# EAGLE design Aldi Ambiano Reflow Oven #Main Board (EAGLE 8.7.0)
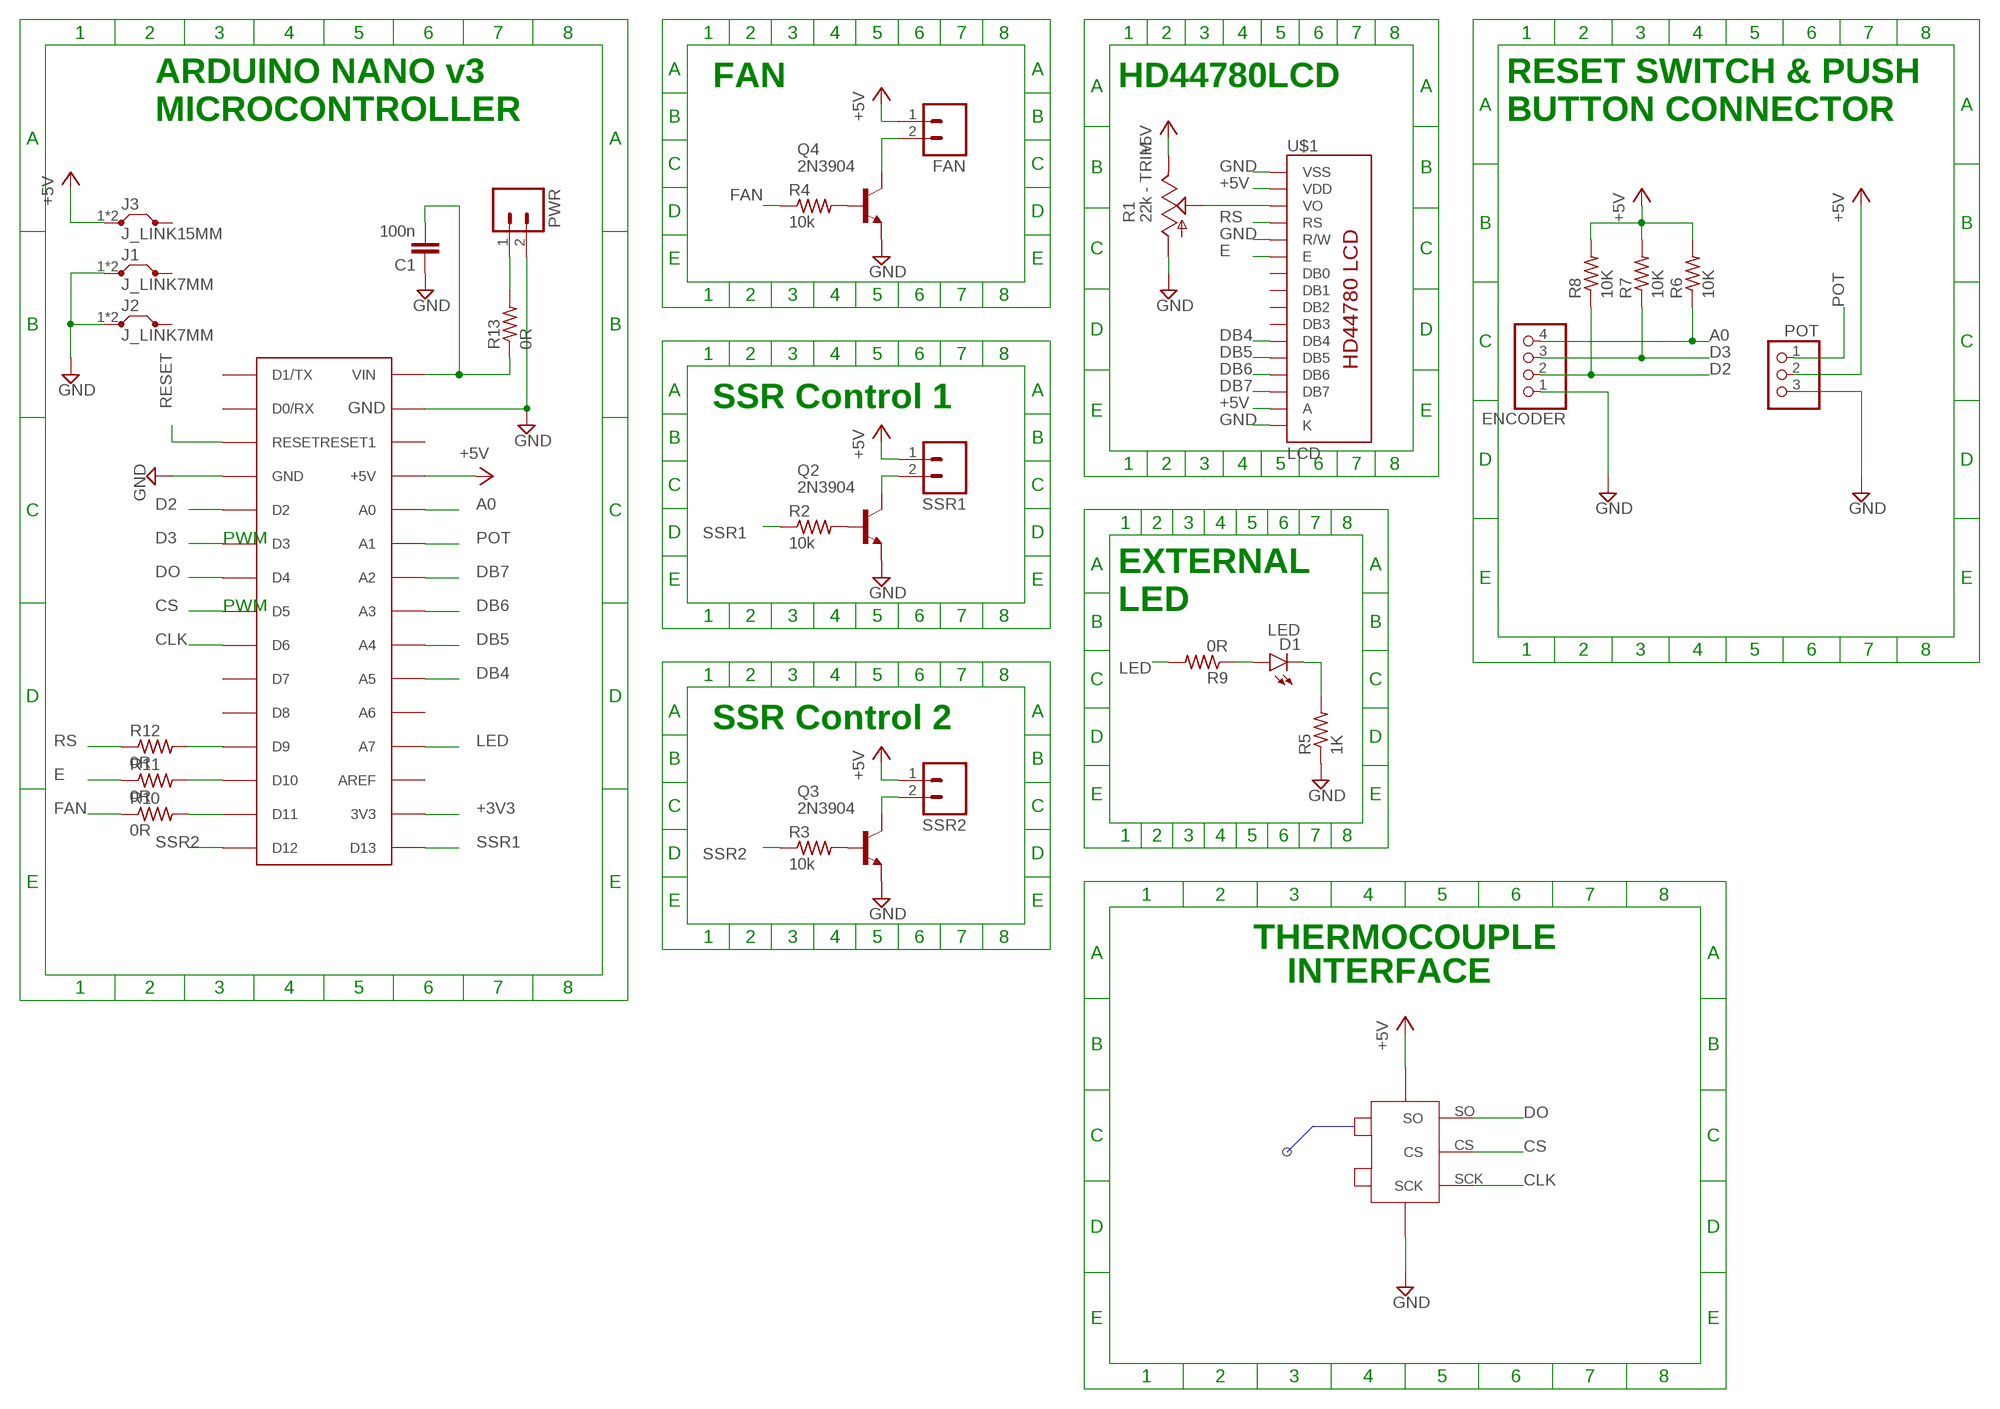
[diagram p0: schematic, sheet 1]

## Parts
ARDUINO  Arduino Nano v3.0  ARDUINONANO  [PDIP-32]
C1  100n  CAPPTH1  [CAP-PTH-5MM]
D1  LED  LED3MM  [LED3MM]
ENCODER  PINHD-1X4/90  [1X04/90]
FAN  M025MM  [SCREWTERMINAL-5MM-2]
J1  J_LINK7MM  [07]
J2  J_LINK7MM  [07]
J3  J_LINK15MM  [15]
POT  PINHD-1X3/90  [1X03/90]
PWR  M025MM  [SCREWTERMINAL-5MM-2]
Q2  2N3904  [TO92]
Q3  2N3904  [TO92]
Q4  2N3904  [TO92]
R1  22k - TRIM  TRIM_US-CA9V  [CA9V]
R2  10k  6MM.3  [R0207/3]
R3  10k  6MM.3  [R0207/3]
R4  10k  6MM.3  [R0207/3]
R5  1K  6MM.3  [R0207/3]
R6  10K  6MM.4  [R0207/4]
R7  10K  6MM.3  [R0207/3]
R8  10K  6MM.4  [R0207/4]
R9  0R  6MM.4  [R0207/4]
R10  0R  6MM.3  [R0207/3]
R11  0R  6MM.6  [R0207/6]
R12  0R  6MM.3  [R0207/3]
R13  0R  6MM.5  [R0207/5]
SSR1  M025MM  [SCREWTERMINAL-5MM-2]
SSR2  M025MM  [SCREWTERMINAL-5MM-2]
U$1  LCD  LCD-HD447804-HOLES16X2-4-HOLES  [LCD-16X2-4HOLES]
U$2  MAX6675_BREAKOUT  [MAX6675_BREAKOUT]

## Nets
+3V3: ARDUINO.3V3
+5V: ARDUINO.+5V FAN.1 J3.1 J3.2 POT.2 R1.E R6.2 R7.2 R8.2 SSR1.1 SSR2.1 U$1.2(VDD) U$1.15(A) U$2.VCC
A0: ARDUINO.A0 ENCODER.4 R6.1
CLK: ARDUINO.D6 U$2.SCK
CS: ARDUINO.D5 U$2.CS
D2: ARDUINO.D2 ENCODER.2 R8.1
D3: ARDUINO.D3 ENCODER.3 R7.1
DB4: ARDUINO.A5 U$1.11(DB4)
DB5: ARDUINO.A4 U$1.12(DB5)
DB6: ARDUINO.A3 U$1.13(DB6)
DB7: ARDUINO.A2 U$1.14(DB7)
DO: ARDUINO.D4 U$2.SO
E: R11.1 U$1.6(E)
EINT: ARDUINO.D10 R11.2
FAN: R4.1 R10.1
FANJOINT: ARDUINO.D11 R10.2
GND: ARDUINO.GND ARDUINO.GND1(GND) C1.1 ENCODER.1 J1.1 J1.2 J2.1 J2.2 POT.3 PWR.2 Q2.3(E) Q3.3(E) Q4.3(E) R1.A R5.1 U$1.1(VSS) U$1.5(R/W) U$1.16(K) U$2.GND
LED: ARDUINO.A7 R9.2
LEDINT: D1.A R9.1
N$1: PWR.1 R13.2
N$2: Q2.1(C) SSR1.2
N$3: Q2.2(B) R2.2
N$5: R1.S U$1.3(VO)
N$6: D1.K(C) R5.2
N$7: Q3.1(C) SSR2.2
N$8: Q3.2(B) R3.2
N$9: FAN.2 Q4.1(C)
N$10: Q4.2(B) R4.2
POT: ARDUINO.A1 POT.1
RESET: ARDUINO.RESET
RS: R12.1 U$1.4(RS)
RSINT: ARDUINO.D9 R12.2
SSR1: ARDUINO.D13 R2.1
SSR2: ARDUINO.D12 R3.1
VIN: ARDUINO.VIN C1.2 R13.1
Unconnected: ARDUINO.A6 ARDUINO.AREF ARDUINO.D0/RX ARDUINO.D1/TX ARDUINO.D7 ARDUINO.D8 ARDUINO.RESET1 U$1.7(DB0) U$1.8(DB1) U$1.9(DB2) U$1.10(DB3)

## Notes on the sheet
- FAN | HD44780LCD
- ARDUINO NANO v3
  MICROCONTROLLER
- RESET SWITCH & PUSH
  BUTTON CONNECTOR
- SSR Control 1
- PWM
- PWM
- EXTERNAL
  LED
- SSR Control 2
- THERMOCOUPLE
- INTERFACE

## Library data of the parts
ARDUINO = jet-lib:ARDUINONANO
C1 = SparkFun-Capacitors:CAP: Capacitor Standard 0603 ceramic capacitor, and 0.1" leaded capacitor.
D1 = gm-diodes:LED
ENCODER = pinhead:PINHD-1X4: PIN HEADER
FAN PWR SSR1 SSR2 = SparkFun-Connectors:M02: Standard 2-pin 0.1" header. Use with - straight break away headers ( PRT-00116) - right angle break away headers (PRT-00553) - swiss pins (PRT-00743) - machine pins (PRT-00117) - female headers (PRT-00115) Molex polarized connector foot print use with: PRT-08233 with associated crimp pins and housings. 2.54_SCREWTERM for use with PRT-10571. 3.5mm Screw Terminal footprints for PRT-08084 5mm Screw Terminal footprints for use with PRT-08432; STOREFRONT_ID: PRT-08432
J1-J3 = jumper_Cheat:J_LINK: Bridge
POT = pinhead:PINHD-1X3: PIN HEADER
Q2-Q4 = transistor-npn:2N3904: NPN Transistor
R1 = pot:TRIM_US-: POTENTIOMETER
R2-R13 = gm-resistors:6MM: 6mm Resistors Leads spaced 1-6 holes apart for 0.1" perfboard. Suitable for 1/4 watt resistors.
U$1 = HD44780LCD:LCD-HD44780
U$2 = Thermocouple:MAX6675_BREAKOUT

## Board
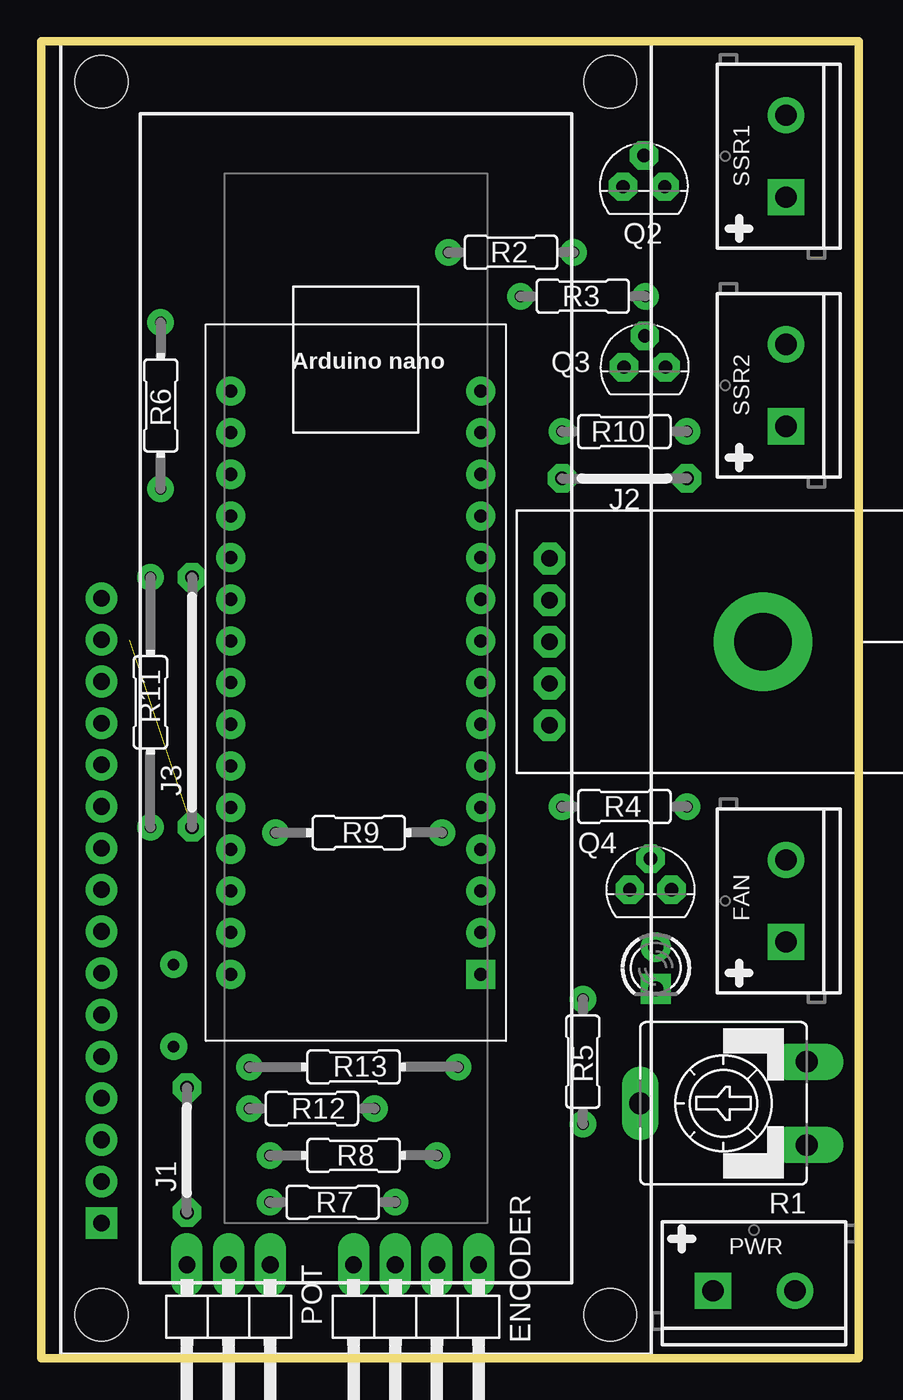
[diagram p1: board, top side]
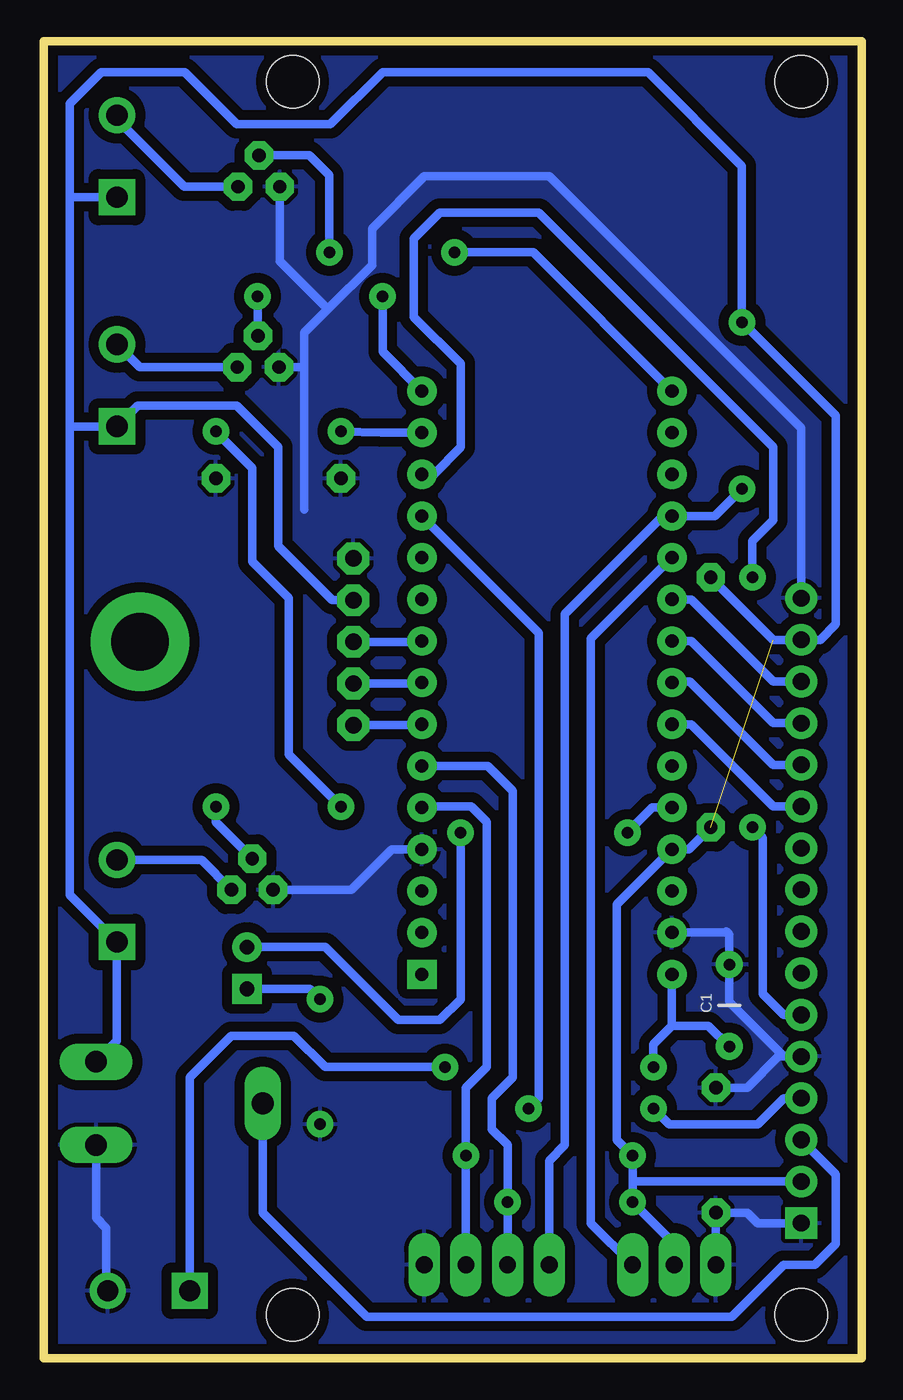
[diagram p2: board, bottom side, seen from below]

Size 49.85 x 80.33 mm. Coordinates in mm from the lower left corner, seen from the top.
Outline: 0,0 49.85,0 49.85,80.33 0,80.33 0,0
Copper layers (1*16): Top 0.035mm / dielectric 1.5mm / Bottom 0.035mm
Design rules "Smart Prototyping": minimum track width 7mil, minimum drill 12mil, track to track 7mil, track to pad 7mil, pad to pad 7mil, via to via 7mil, smd to smd 0mil, copper to edge 20mil, drill to drill 10mil, minimum pad ring 18mil, minimum via ring 6mil, stop-mask expansion 2mil, vias tented up to drill 25mil, thermal gap 10mil

### Footprints (pad centres in the part's own frame; a part is rotated, then mirrored left to right if it is on the bottom)
PDIP-32 = drill 0.8 pad 1.778: 3V3 15.24,-35.56; +5V 15.24,-10.16; A0 15.24,-30.48; A1 15.24,-27.94; A2 15.24,-25.4; A3 15.24,-22.86; A4 15.24,-20.32; A5 15.24,-17.78; A6 15.24,-15.24; A7 15.24,-12.7; AREF 15.24,-33.02; D0/RX 0,-5.08; D2 0,-12.7; D3 0,-15.24; D4 0,-17.78; D5 0,-20.32; D6 0,-22.86; D7 0,-25.4; D8 0,-27.94; D9 0,-30.48; D10 0,-33.02; D11 0,-35.56; D12 0,-38.1; D13 15.24,-38.1; GND 0,-10.16; GND1 15.24,-5.08; RESET 0,-7.62; RESET1 15.24,-7.62; VIN 15.24,-2.54 | drill 0.8 pad 1.778 square: D1/TX 0,-2.54
CAP-PTH-5MM = drill 0.7 pad 1.651: 1 -2.5,0; 2 2.5,0
LED3MM = drill 0.9: A -1.27,0 | drill 0.9 square: K 1.27,0
1X04/90 = drill 1.016 long: 1 -3.81,-3.81; 2 -1.27,-3.81; 3 1.27,-3.81; 4 3.81,-3.81
SCREWTERMINAL-5MM-2 = drill 1.3 pad 2.032 square: 1 0,0 | drill 1.3 pad 2.032: 2 5,0
07 = drill 0.813 pad 1.6 octagon: 1 -3.81,0; 2 3.81,0
15 = drill 0.813 pad 1.6 octagon: 1 -7.62,0; 2 7.62,0
1X03/90 = drill 1.016 long: 1 -2.54,-3.81; 2 0,-3.81; 3 2.54,-3.81
TO92 = drill 0.813 octagon: 1 1.27,0; 2 0,1.905; 3 -1.27,0
CA9V = drill 1.321 long: A -2.54,-5.08; E 2.54,-5.08; S 0,5.08
R0207/3 = drill 0.7: 1 -3.81,0; 2 3.81,0
R0207/4 = drill 0.7: 1 -5.08,0; 2 5.08,0
R0207/6 = drill 0.7: 1 -7.62,0; 2 7.62,0
R0207/5 = drill 0.7: 1 -6.35,0; 2 6.35,0
LCD-16X2-4HOLES = drill 1.016 square: 1 -32,15.5 | drill 1.016: 2 -29.46,15.5; 3 -26.92,15.5; 4 -24.38,15.5; 5 -21.84,15.5; 6 -19.3,15.5; 7 -16.76,15.5; 8 -14.22,15.5; 9 -11.68,15.5; 10 -9.14,15.5; 11 -6.6,15.5; 12 -4.06,15.5; 13 -1.52,15.5; 14 1.02,15.5; 15 3.56,15.5; 16 6.1,15.5 | hole 3.2: -37.6,15.5; -37.6,-15.5; 37.6,-15.5; 37.6,15.5
MAX6675_BREAKOUT = drill 1 pad 1.93 octagon: CS 10.54,2; GND 2.92,2; SCK 8,2; SO 13.08,2; VCC 5.46,2 | drill 3.5 pad 6: PAD 8,15

### Placement (x,y rotation side)
ARDUINO  26.81,20.89 180 top
C1  8.08,21.52 270 bottom
D1  37.47,23.81 270 top
ENCODER  22.86,1.91 180 top
FAN  45.4,25.4 90 top
J1  8.89,12.7 90 top
J2  35.56,53.66 0 top
J3  9.21,40.01 90 top
POT  11.43,1.91 180 top
PWR  40.96,4.13 0 top
Q2  36.74,71.45 0 top
Q3  36.79,60.44 0 top
Q4  37.15,28.57 0 top
R1  41.59,15.56 90 top
R2  28.64,67.45 0 top
R3  33.02,64.77 0 top
R4  35.56,33.66 0 top
R5  33.02,18.1 90 top
R6  7.3,58.1 90 top
R7  17.78,9.53 180 top
R8  19.05,12.38 180 top
R9  19.37,32.07 180 top
R10  35.56,56.52 180 top
R11  6.67,40.01 90 top
R12  16.51,15.24 0 top
R13  19.05,17.78 0 top
SSR1  45.4,70.8 90 top
SSR2  45.4,56.83 90 top
U$1  19.19,40.26 90 top
U$2  28.99,51.7 270 top

### Tracks (layer width: path | path; a pad name or v marks a point on that pad's centre or on a via)
+5V  (1 unrouted)
  Bottom 0.508: 48.26,56.83 48.26,28.26 FAN.1 45.4,19.37 R1.E | 48.26,56.83 SSR2.1 44.13,58.1 38.1,58.1 35.56,55.56 35.56,49.53 32.27,46.24 U$2.VCC | 48.26,56.83 48.26,70.8 | 48.26,70.8 48.26,76.52 46.36,78.42 41.27,78.42 38.1,75.25 32.39,75.25 29.21,78.42 13.02,78.42 7.3,72.71 R6.2 1.59,57.48 1.59,44.77 2.54,43.81 U$1.15 5.4,43.81 J3.2 | SSR1.1 48.26,70.8 | 13.97,10.79 R8.2 14.92,13.34 14.92,27.7 ARDUINO.+5V 10.54,31.05 J3.1 | 13.97,10.79 R7.2 11.43,6.99 POT.2 | U$1.2 13.97,10.79
A0
  Bottom 0.508: ENCODER.4 19.05,12.06 18.1,13.02 18.1,45.4 12.13,51.37 ARDUINO.A0 | 11.5,51.44 ARDUINO.A0 | ARDUINO.A0 8.95,51.37 R6.1
CLK
  Bottom 0.508: U$2.SCK 27.18,43.7 ARDUINO.D6
CS
  Bottom 0.508: U$2.CS 27.18,41.16 ARDUINO.D5
D2
  Bottom 0.508: ENCODER.2 R8.1 24.13,16.51 22.86,17.78 22.86,32.7 23.81,33.66 26.74,33.66 ARDUINO.D2
D3
  Bottom 0.508: ARDUINO.D3 22.79,36.13 21.27,34.61 21.27,17.14 22.54,15.88 22.54,13.97 21.59,13.02 R7.1 ENCODER.3
DB4
  Bottom 0.508: ARDUINO.A5 10.41,38.67 5.4,33.66 U$1.11
DB5
  Bottom 0.508: U$1.12 5.4,36.2 10.48,41.27 11.5,41.27 ARDUINO.A4
DB6
  Bottom 0.508: ARDUINO.A3 10.41,43.75 5.4,38.73 U$1.13
DB7
  Bottom 0.508: U$1.14 5.4,41.27 10.41,46.29 ARDUINO.A2
DO
  Bottom 0.508: ARDUINO.D4 26.86,38.62 U$2.SO
E
  Bottom 0.508: U$1.6 4.76,20.95 6.03,22.23 6.03,31.75 R11.1
EINT
  Bottom 0.508: R11.2 6.67,49.85 5.4,51.12 5.4,55.56 19.69,69.85 25.72,69.85 27.3,68.26 27.3,63.5 24.45,60.64 24.45,55.56 26.1,53.91 ARDUINO.D10
FAN
  Bottom 0.508: R4.1 34.92,36.83 34.92,46.35 37.15,48.58 37.15,54.29 R10.1
FANJOINT
  Bottom 0.508: R10.2 29.28,56.45 ARDUINO.D11
GND
  Bottom 0.508: U$1.1 6.35,8.26 6.98,8.89 J1.1 POT.3 | ARDUINO.GND 28.64,31.05 31.12,28.57 Q4.3 | U$1.16 3.69,56.71 19.05,72.07 26.67,72.07 29.84,68.9 29.84,66.67 32.54,63.98 | 32.54,63.98 33.97,62.55 33.97,60.33 | Q2.3 35.47,66.9 32.54,63.98 | 33.97,60.33 33.97,51.76 | Q3.3 34.18,60.44 33.97,60.33 | J1.2 6.98,16.51 5.08,18.41 U$1.5 4.76,18.41 8.08,21.73 C1.1 8.08,25.86 8.26,26.04 8.32,25.97 ARDUINO.GND1 | R1.A 46.67,8.57 46.04,7.94 46.04,4.21 PWR.2
  pour Bottom (isolate 0.61): 0,80.33 49.85,80.33 49.85,0 0,0
LED
  Bottom 0.508: R9.2 12.77,33.59 ARDUINO.A7
LEDINT
  Bottom 0.508: D1.A 32.7,25.08 28.26,20.64 25.72,20.64 24.45,21.91 R9.1
N$1
  Bottom 0.508: PWR.1 40.96,17.14 38.42,19.68 34.61,19.68 32.7,17.78 R13.2
N$2
  Bottom 0.508: SSR1.2 45.4,75.56 41.29,71.45 Q2.1
N$3
  Bottom 0.508: Q2.2 33.67,73.36 32.45,72.14 R2.2
N$5
  Bottom 0.508: U$1.3 1.59,11.23 1.59,6.99 2.86,5.71 4.76,5.71 7.94,2.54 30.16,2.54 36.51,8.89 R1.S
N$6
  Bottom 0.508: D1.K 33.66,22.54 R5.2
N$7
  Bottom 0.508: Q3.1 44.01,60.44 SSR2.2
N$8
  Bottom 0.508: Q3.2 36.83,62.38 R3.2
N$9
  Bottom 0.508: FAN.2 40.24,30.4 Q4.1
N$10
  Bottom 0.508: Q4.2 39.37,32.7 R4.2
POT
  Bottom 0.508: ARDUINO.A1 16.51,43.89 16.51,8.26 POT.1
RS
  Bottom 0.508: R12.1 11.75,14.29 6.35,14.29 4.76,15.88 U$1.4
RSINT
  Bottom 0.508: R12.2 19.69,15.88 19.69,44.24 ARDUINO.D9
SSR1
  Bottom 0.508: 11.75,59.16 ARDUINO.D13 20.03,67.45 R2.1
SSR2
  Bottom 0.508: ARDUINO.D12 29.21,61.39 R3.1
VIN
  Bottom 0.508: 11.57,20.29 ARDUINO.VIN | R13.1 12.7,19.16 11.57,20.29 | C1.2 9.35,20.29 11.57,20.29

### Text on the board
tPlace: Arduino nano